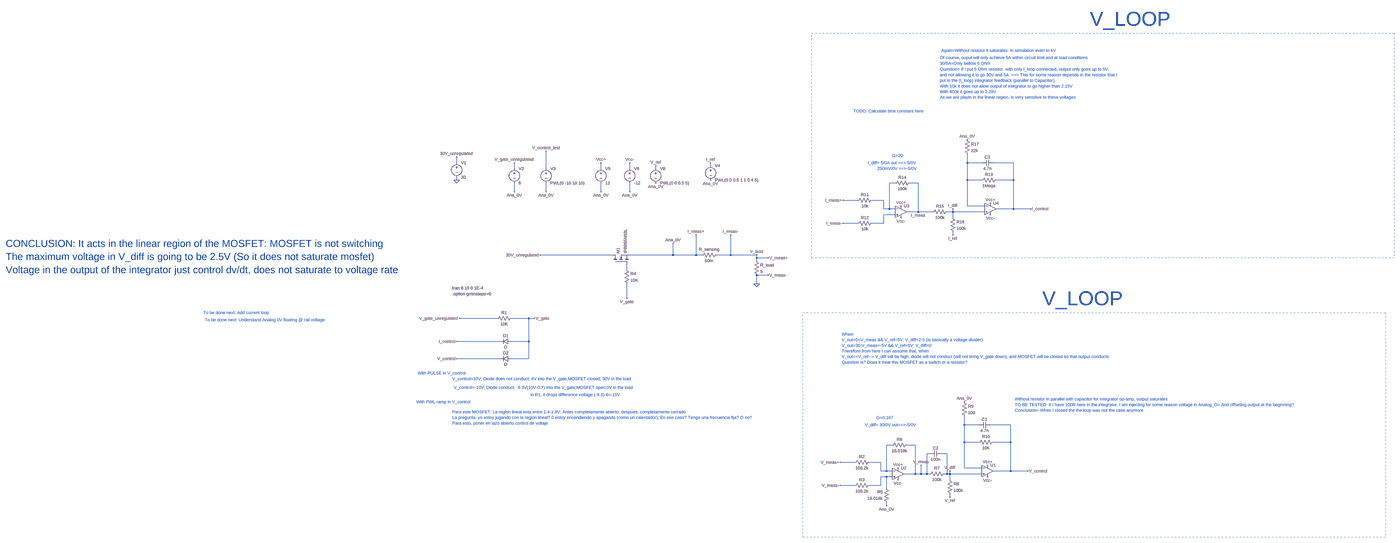
[diagram p0: schematic ControlSimulation_TOTAL_WORKING.asc, whole sheet]
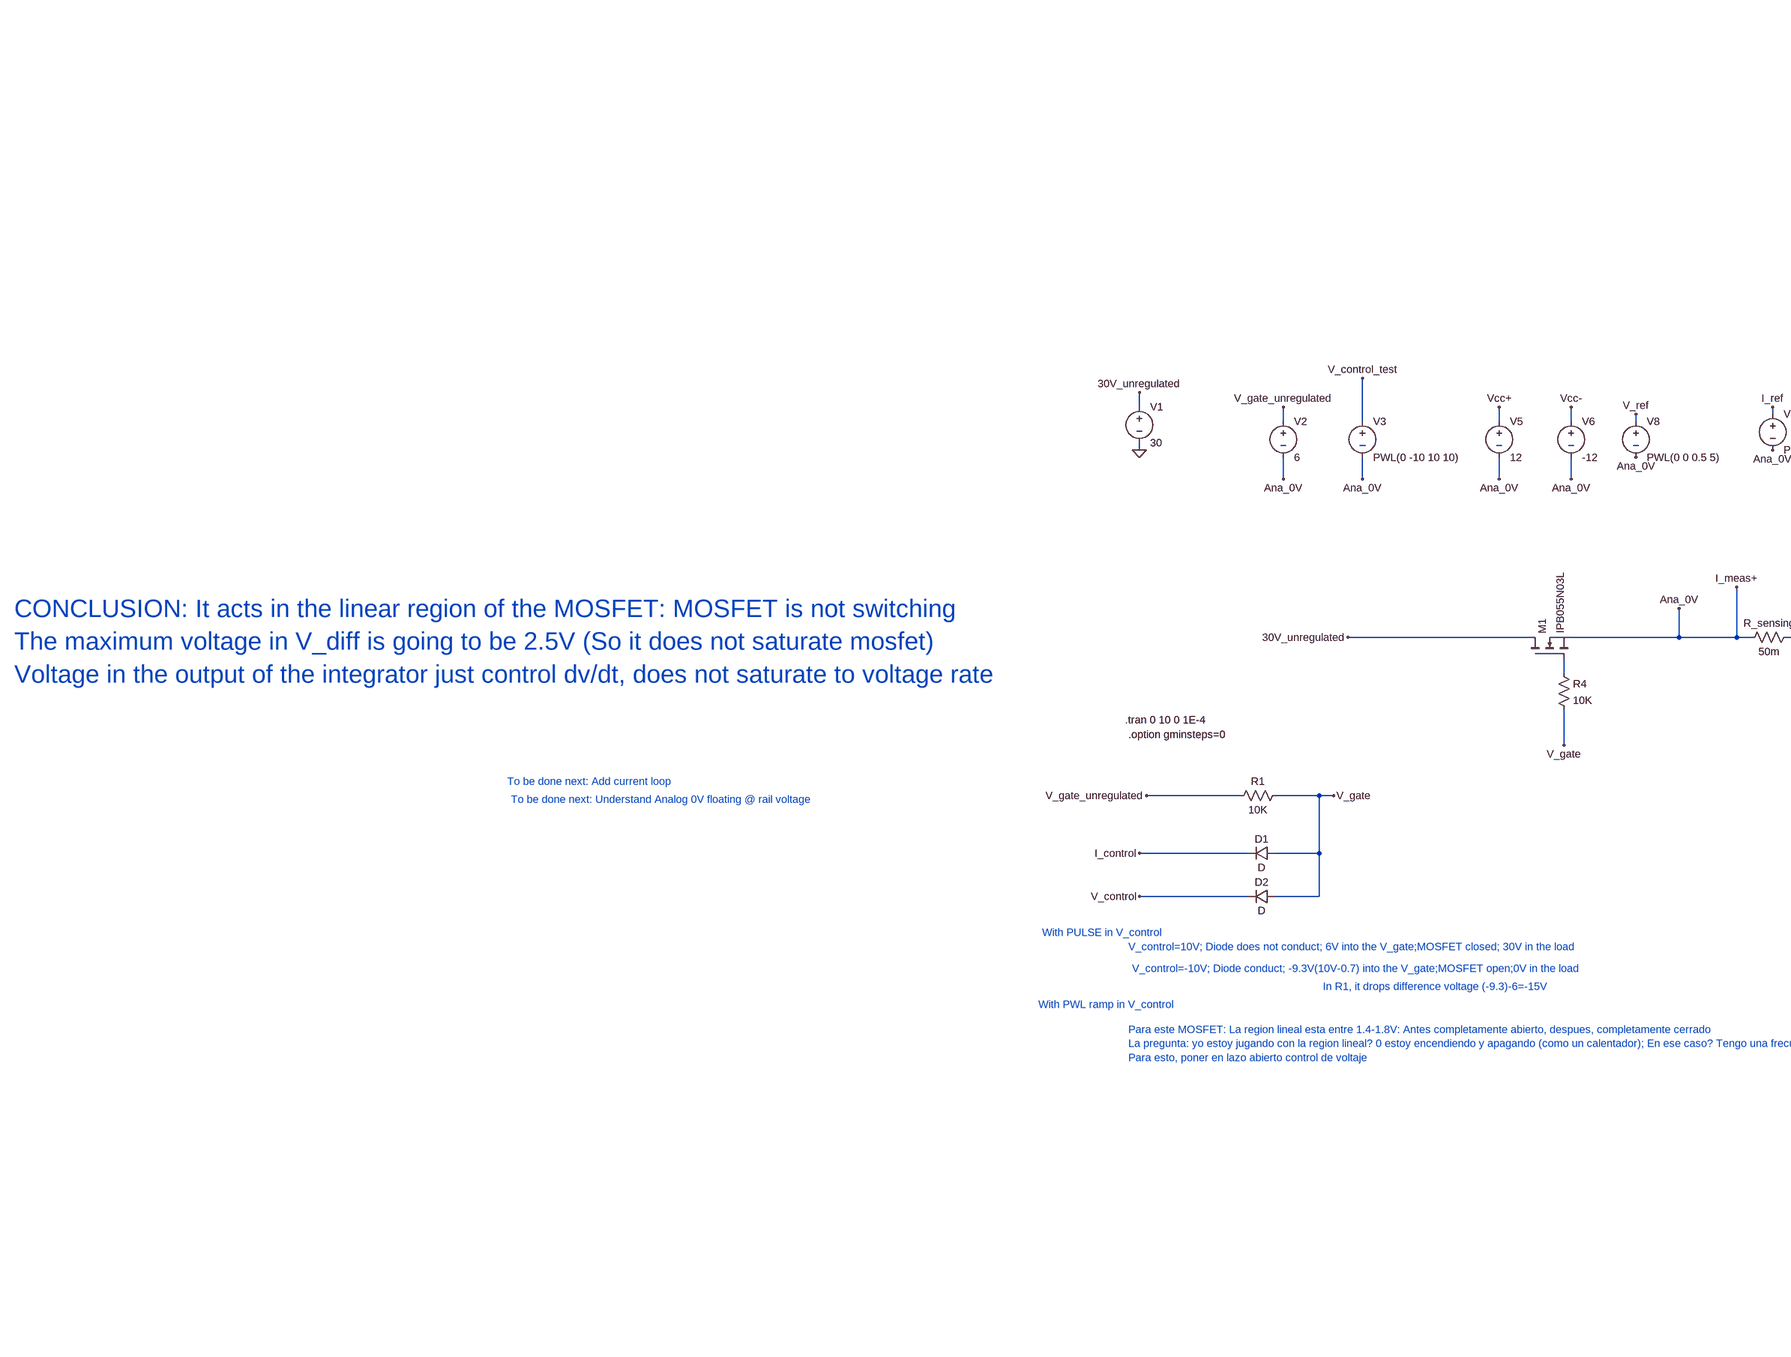
[diagram p1: schematic ControlSimulation_TOTAL_WORKING.asc, part, row 1 of 1, column 1 of 2]
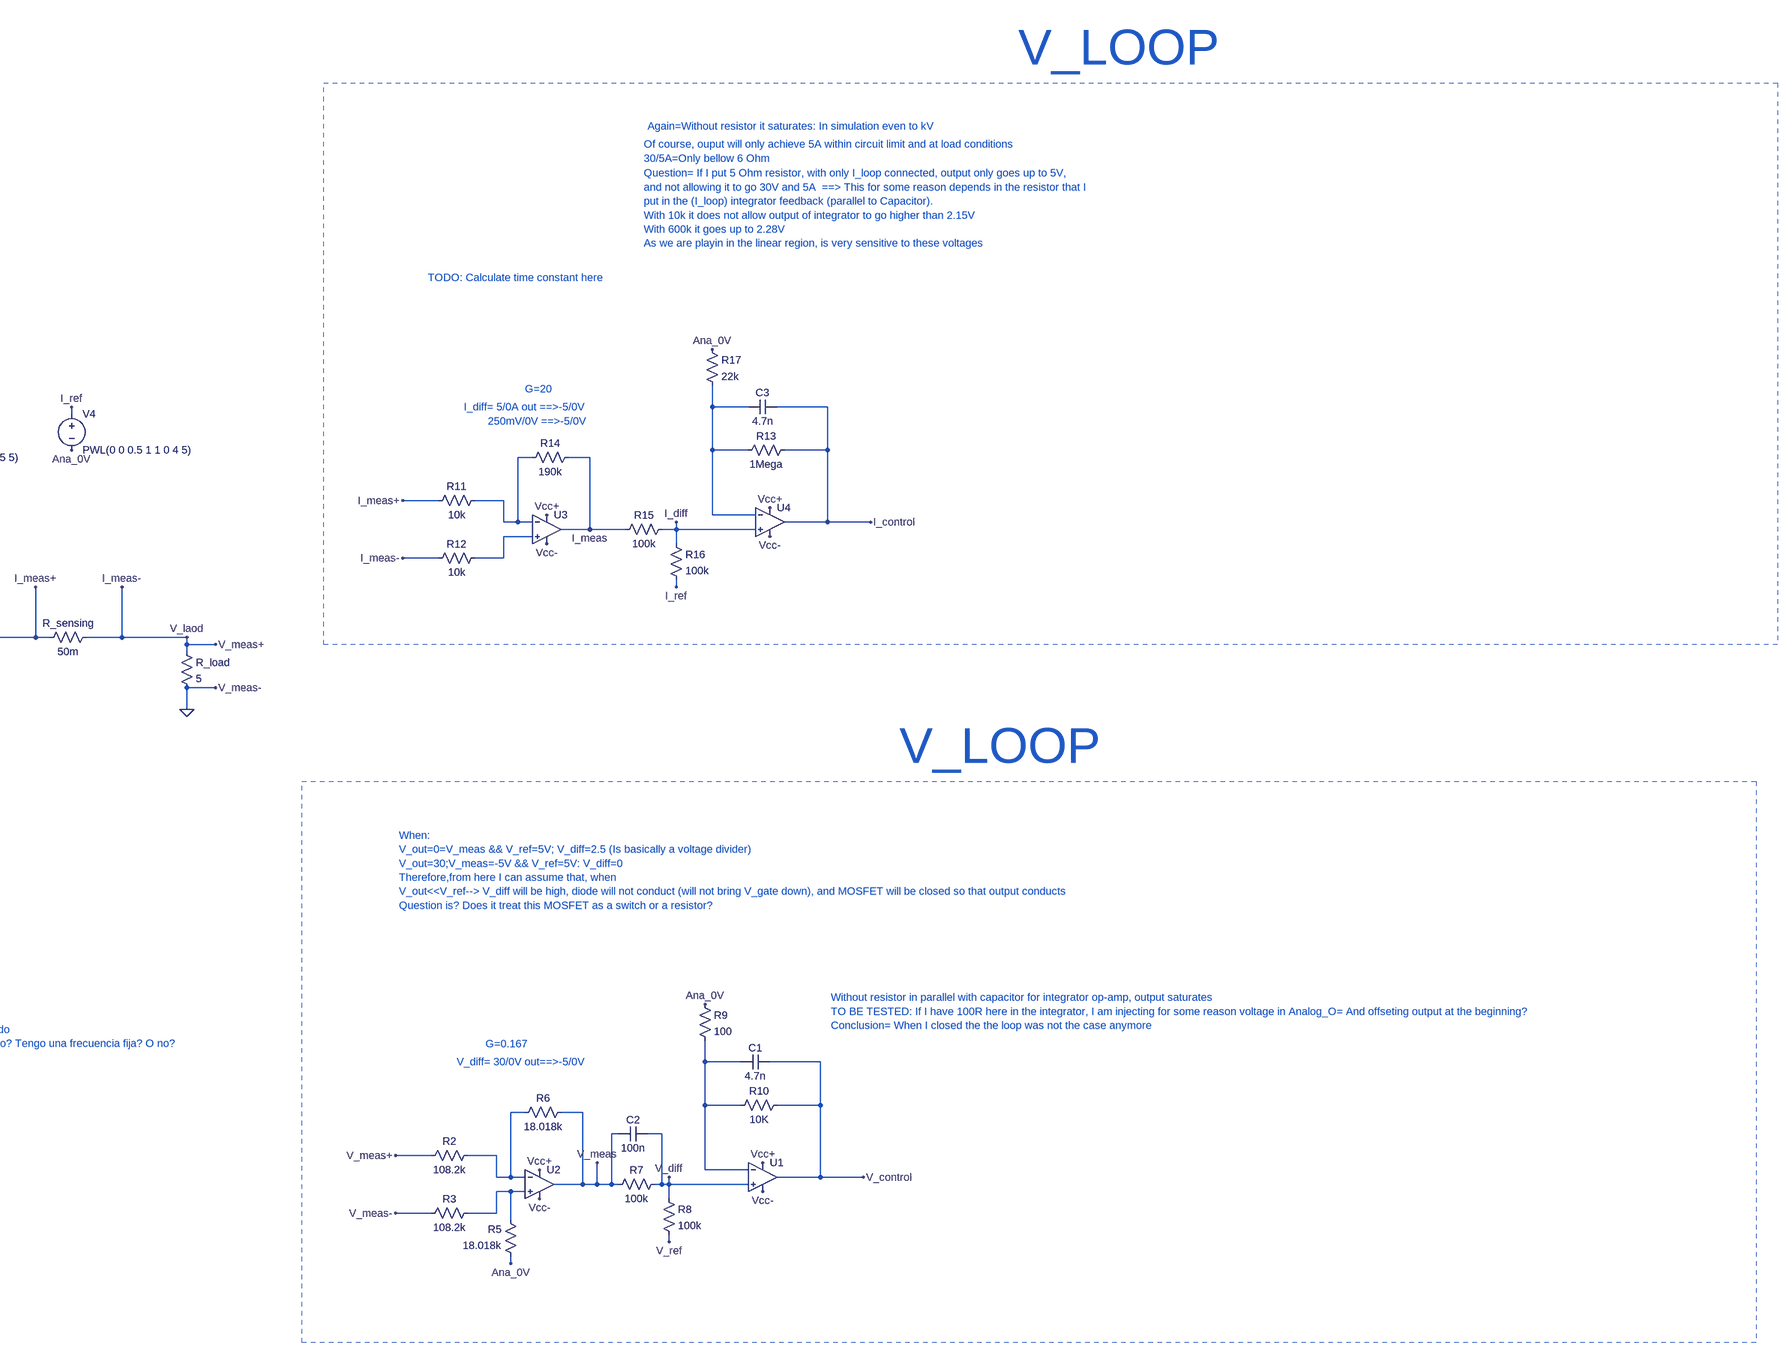
[diagram p2: schematic ControlSimulation_TOTAL_WORKING.asc, part, row 1 of 1, column 2 of 2]
ControlSimulation_TOTAL_WORKING.asc, the LTspice schematic file:
Version 4.1
SHEET 1 4756 1956
WIRE -448 -128 -448 -160
WIRE 2384 -128 2384 -176
WIRE 2464 -128 2384 -128
WIRE 2640 -128 2528 -128
WIRE 960 -112 960 -128
WIRE -128 -96 -128 -128
WIRE 48 -96 48 -192
WIRE 352 -96 352 -128
WIRE 512 -96 512 -128
WIRE 656 -96 656 -112
WIRE -448 -32 -448 -48
WIRE 2384 -32 2384 -128
WIRE 2464 -32 2384 -32
WIRE 2640 -32 2640 -128
WIRE 2640 -32 2544 -32
WIRE 1984 -16 1952 -16
WIRE 2112 -16 2064 -16
WIRE -128 32 -128 -16
WIRE 48 32 48 -16
WIRE 352 32 352 -16
WIRE 512 32 512 -16
WIRE 1776 80 1696 80
WIRE 1920 80 1856 80
WIRE 2384 112 2384 -32
WIRE 2480 112 2384 112
WIRE 1920 128 1920 80
WIRE 1952 128 1952 -16
WIRE 1952 128 1920 128
WIRE 1984 128 1952 128
WIRE 2640 128 2640 -32
WIRE 2640 128 2544 128
WIRE 2736 128 2640 128
WIRE 2112 144 2112 -16
WIRE 2112 144 2048 144
WIRE 2192 144 2112 144
WIRE 2304 144 2304 128
WIRE 2304 144 2272 144
WIRE 2480 144 2304 144
WIRE 1984 160 1920 160
WIRE 2304 176 2304 144
WIRE 1776 208 1696 208
WIRE 1920 208 1920 160
WIRE 1920 208 1856 208
WIRE 2304 272 2304 256
WIRE 416 384 16 384
WIRE 752 384 752 320
WIRE 752 384 512 384
WIRE 880 384 880 272
WIRE 880 384 752 384
WIRE 912 384 880 384
WIRE 1072 384 1072 272
WIRE 1072 384 992 384
WIRE 1216 384 1072 384
WIRE 1216 400 1216 384
WIRE 1280 400 1216 400
WIRE 1216 416 1216 400
WIRE 496 464 496 432
WIRE 1280 496 1216 496
WIRE 1216 544 1216 496
WIRE 496 624 496 544
WIRE -224 736 -432 736
WIRE -48 736 -144 736
WIRE -16 736 -48 736
WIRE -208 864 -448 864
WIRE -48 864 -48 736
WIRE -48 864 -144 864
WIRE -208 960 -448 960
WIRE -48 960 -48 864
WIRE -48 960 -144 960
WIRE 2368 1328 2368 1280
WIRE 2448 1328 2368 1328
WIRE 2624 1328 2512 1328
WIRE 2368 1424 2368 1328
WIRE 2448 1424 2368 1424
WIRE 2624 1424 2624 1328
WIRE 2624 1424 2528 1424
WIRE 1968 1440 1936 1440
WIRE 2096 1440 2048 1440
WIRE 2176 1488 2160 1488
WIRE 2272 1488 2240 1488
WIRE 1760 1536 1680 1536
WIRE 1904 1536 1840 1536
WIRE 2368 1568 2368 1424
WIRE 2464 1568 2368 1568
WIRE 1904 1584 1904 1536
WIRE 1936 1584 1936 1440
WIRE 1936 1584 1904 1584
WIRE 1968 1584 1936 1584
WIRE 2624 1584 2624 1424
WIRE 2624 1584 2528 1584
WIRE 2720 1584 2624 1584
WIRE 2096 1600 2096 1440
WIRE 2096 1600 2032 1600
WIRE 2128 1600 2128 1552
WIRE 2128 1600 2096 1600
WIRE 2160 1600 2160 1488
WIRE 2160 1600 2128 1600
WIRE 2176 1600 2160 1600
WIRE 2272 1600 2272 1488
WIRE 2272 1600 2256 1600
WIRE 2288 1600 2288 1584
WIRE 2288 1600 2272 1600
WIRE 2464 1600 2288 1600
WIRE 1936 1616 1904 1616
WIRE 1968 1616 1936 1616
WIRE 2288 1632 2288 1600
WIRE 1760 1664 1680 1664
WIRE 1904 1664 1904 1616
WIRE 1904 1664 1840 1664
WIRE 1936 1680 1936 1616
WIRE 2288 1728 2288 1712
WIRE 1936 1776 1936 1760
FLAG -448 -160 30V_unregulated
FLAG -448 -32 0
FLAG 16 384 30V_unregulated
FLAG 1216 544 0
FLAG 1216 384 V_laod
FLAG 496 624 V_gate
FLAG 752 320 Ana_0V
FLAG -128 32 Ana_0V
FLAG -128 -128 V_gate_unregulated
FLAG -432 736 V_gate_unregulated
FLAG -16 736 V_gate
FLAG -448 864 I_control
FLAG 48 32 Ana_0V
FLAG 48 -192 V_control_test
FLAG 352 32 Ana_0V
FLAG 352 -128 Vcc+
FLAG 512 32 Ana_0V
FLAG 512 -128 Vcc-
FLAG 2000 1568 Vcc+
FLAG 2000 1632 Vcc-
FLAG 656 -16 Ana_0V
FLAG 656 -112 V_ref
FLAG 1936 1776 Ana_0V
FLAG 2128 1552 V_meas
FLAG 2288 1728 V_ref
FLAG 2288 1584 V_diff
FLAG 2496 1552 Vcc+
FLAG 2496 1616 Vcc-
FLAG 2720 1584 V_control
FLAG 2368 1200 Ana_0V
FLAG 1280 400 V_meas+
FLAG 1280 496 V_meas-
FLAG 1680 1536 V_meas+
FLAG 1680 1664 V_meas-
FLAG 880 272 I_meas+
FLAG 1072 272 I_meas-
FLAG 2016 112 Vcc+
FLAG 2016 176 Vcc-
FLAG 2304 272 I_ref
FLAG 2304 128 I_diff
FLAG 2512 96 Vcc+
FLAG 2512 160 Vcc-
FLAG 2736 128 I_control
FLAG 2384 -256 Ana_0V
FLAG 1696 80 I_meas+
FLAG 1696 208 I_meas-
FLAG 960 -32 Ana_0V
FLAG 960 -128 I_ref
FLAG 2112 144 I_meas
FLAG -448 960 V_control
SYMBOL voltage -448 -144 R0
WINDOW 123 0 0 Left 0
WINDOW 39 0 0 Left 0
SYMATTR InstName V1
SYMATTR Value 30
SYMBOL nmos 416 432 R270
SYMATTR InstName M1
SYMATTR Value IPB055N03L
SYMBOL res 1200 400 R0
SYMATTR InstName R_load
SYMATTR Value 5
SYMBOL res 480 448 R0
SYMATTR InstName R4
SYMATTR Value 10K
SYMBOL res 1008 368 R90
WINDOW 0 0 56 VBottom 2
WINDOW 3 32 56 VTop 2
SYMATTR InstName R_sensing
SYMATTR Value 50m
SYMBOL voltage -128 -112 R0
WINDOW 123 0 0 Left 0
WINDOW 39 0 0 Left 0
SYMATTR InstName V2
SYMATTR Value 6
SYMBOL res -128 720 R90
WINDOW 0 0 56 VBottom 2
WINDOW 3 32 56 VTop 2
SYMATTR InstName R1
SYMATTR Value 10K
SYMBOL diode -144 848 R90
WINDOW 0 0 32 VBottom 2
WINDOW 3 32 32 VTop 2
SYMATTR InstName D1
SYMBOL voltage 48 -112 R0
WINDOW 123 0 0 Left 0
WINDOW 39 0 0 Left 0
SYMATTR InstName V3
SYMATTR Value PWL(0 -10 10 10)
SYMBOL voltage 352 -112 R0
WINDOW 123 0 0 Left 0
WINDOW 39 0 0 Left 0
SYMATTR InstName V5
SYMATTR Value 12
SYMBOL voltage 512 -112 R0
WINDOW 123 0 0 Left 0
WINDOW 39 0 0 Left 0
SYMATTR InstName V6
SYMATTR Value -12
SYMBOL voltage 656 -112 R0
WINDOW 123 0 0 Left 0
WINDOW 39 0 0 Left 0
SYMATTR InstName V8
SYMATTR Value PWL(0 0 0.5 5)
SYMBOL res 1856 1520 R90
WINDOW 0 0 56 VBottom 2
WINDOW 3 32 56 VTop 2
SYMATTR InstName R2
SYMATTR Value 108.2k
SYMBOL res 1856 1648 R90
WINDOW 0 0 56 VBottom 2
WINDOW 3 32 56 VTop 2
SYMATTR InstName R3
SYMATTR Value 108.2k
SYMBOL res 1952 1776 R180
WINDOW 0 36 76 Left 2
WINDOW 3 36 40 Left 2
SYMATTR InstName R5
SYMATTR Value 18.018k
SYMBOL res 2064 1424 R90
WINDOW 0 0 56 VBottom 2
WINDOW 3 32 56 VTop 2
SYMATTR InstName R6
SYMATTR Value 18.018k
SYMBOL res 2272 1584 R90
WINDOW 0 0 56 VBottom 2
WINDOW 3 32 56 VTop 2
SYMATTR InstName R7
SYMATTR Value 100k
SYMBOL res 2272 1616 R0
SYMATTR InstName R8
SYMATTR Value 100k
SYMBOL cap 2512 1312 R90
WINDOW 0 0 32 VBottom 2
WINDOW 3 32 32 VTop 2
SYMATTR InstName C1
SYMATTR Value 4.7n
SYMBOL res 2352 1184 R0
SYMATTR InstName R9
SYMATTR Value 100
SYMBOL res 2544 1408 R90
WINDOW 0 0 56 VBottom 2
WINDOW 3 32 56 VTop 2
SYMATTR InstName R10
SYMATTR Value 10K
SYMBOL OpAmps\\UniversalOpAmp1 2000 1600 R0
SYMATTR InstName U2
SYMBOL OpAmps\\UniversalOpAmp1 2496 1584 R0
SYMATTR InstName U1
SYMBOL cap 2240 1472 R90
WINDOW 0 0 32 VBottom 2
WINDOW 3 32 32 VTop 2
SYMATTR InstName C2
SYMATTR Value 100n
SYMBOL res 1872 64 R90
WINDOW 0 0 56 VBottom 2
WINDOW 3 32 56 VTop 2
SYMATTR InstName R11
SYMATTR Value 10k
SYMBOL res 1872 192 R90
WINDOW 0 0 56 VBottom 2
WINDOW 3 32 56 VTop 2
SYMATTR InstName R12
SYMATTR Value 10k
SYMBOL res 2080 -32 R90
WINDOW 0 0 56 VBottom 2
WINDOW 3 32 56 VTop 2
SYMATTR InstName R14
SYMATTR Value 190k
SYMBOL res 2288 128 R90
WINDOW 0 0 56 VBottom 2
WINDOW 3 32 56 VTop 2
SYMATTR InstName R15
SYMATTR Value 100k
SYMBOL res 2288 160 R0
SYMATTR InstName R16
SYMATTR Value 100k
SYMBOL cap 2528 -144 R90
WINDOW 0 0 32 VBottom 2
WINDOW 3 32 32 VTop 2
SYMATTR InstName C3
SYMATTR Value 4.7n
SYMBOL res 2368 -272 R0
SYMATTR InstName R17
SYMATTR Value 22k
SYMBOL OpAmps\\UniversalOpAmp1 2016 144 R0
SYMATTR InstName U3
SYMBOL OpAmps\\UniversalOpAmp1 2512 128 R0
SYMATTR InstName U4
SYMBOL voltage 960 -128 R0
WINDOW 123 0 0 Left 0
WINDOW 39 0 0 Left 0
SYMATTR InstName V4
SYMATTR Value PWL(0 0 0.5 1 1 0 4 5)
SYMBOL res 2560 -48 R90
WINDOW 0 0 56 VBottom 2
WINDOW 3 32 56 VTop 2
SYMATTR InstName R13
SYMATTR Value 1Mega
SYMBOL diode -144 944 R90
WINDOW 0 0 32 VBottom 2
WINDOW 3 32 32 VTop 2
SYMATTR InstName D2
TEXT -480 568 Left 2 !.tran 0 10 0 1E-4
TEXT -472 1072 Left 2 ;V_control=10V; Diode does not conduct; 6V into the V_gate;MOSFET closed; 30V in the load
TEXT -464 1120 Left 2 ;V_control=-10V; Diode conduct; -9.3V(10V-0.7) into the V_gate;MOSFET open;0V in the load
TEXT -40 1160 Left 2 ;In R1, it drops difference voltage (-9.3)-6=-15V
TEXT -664 1040 Left 2 ;With PULSE in V_control
TEXT -672 1200 Left 2 ;With PWL ramp in V_control
TEXT -472 1256 Left 2 ;Para este MOSFET: La region lineal esta entre 1.4-1.8V: Antes completamente abierto, despues, completamente cerrado\nLa pregunta: yo estoy jugando con la region lineal? 0 estoy encendiendo y apagando (como un calentador); En ese caso? Tengo una frecuencia fija? O no?\nPara esto, poner en lazo abierto control de voltaje
TEXT 1816 1328 Left 2 ;V_diff= 30/0V out==>-5/0V
TEXT 1688 824 Left 2 ;When:\nV_out=0=V_meas && V_ref=5V; V_diff=2.5 (Is basically a voltage divider)\nV_out=30;V_meas=-5V && V_ref=5V: V_diff=0\nTherefore,from here I can assume that, when\nV_out<<V_ref--> V_diff will be high, diode will not conduct (will not bring V_gate down), and MOSFET will be closed so that output conducts\nQuestion is? Does it treat this MOSFET as a switch or a resistor?
TEXT -472 600 Left 2 !.option gminsteps=0
TEXT 2648 1184 Left 2 ;Without resistor in parallel with capacitor for integrator op-amp, output saturates
TEXT 2648 1216 Left 2 ;TO BE TESTED: If I have 100R here in the integrator, I am injecting for some reason voltage in Analog_O= And offseting output at the beginning?\nConclusion= When I closed the the loop was not the case anymore
TEXT -3304 320 Left 5 ;CONCLUSION: It acts in the linear region of the MOSFET: MOSFET is not switching\nThe maximum voltage in V_diff is going to be 2.5V (So it does not saturate mosfet)\nVoltage in the output of the integrator just control dv/dt, does not saturate to voltage rate
TEXT -2208 704 Left 2 ;To be done next: Add current loop
TEXT 2800 624 Left 7 ;V_LOOP
TEXT 1832 -128 Left 2 ;I_diff= 5/0A out ==>-5/0V\n        250mV/0V ==>-5/0V
TEXT 1752 -416 Left 2 ;TODO: Calculate time constant here
TEXT -2200 744 Left 2 ;To be done next: Understand Analog 0V floating @ rail voltage
TEXT 1968 -168 Left 2 ;G=20
TEXT 1880 1288 Left 2 ;G=0.167
TEXT 2240 -752 Left 2 ;Again=Without resistor it saturates: In simulation even to kV
TEXT 2232 -712 Left 2 ;Of course, ouput will only achieve 5A within circuit limit and at load conditions\n30/5A=Only bellow 6 Ohm
TEXT 2232 -648 Left 2 ;Question= If I put 5 Ohm resistor, with only I_loop connected, output only goes up to 5V,\nand not allowing it to go 30V and 5A  ==> This for some reason depends in the resistor that I \nput in the (I_loop) integrator feedback (parallel to Capacitor).\nWith 10k it does not allow output of integrator to go higher than 2.15V\nWith 600k it goes up to 2.28V\nAs we are playin in the linear region, is very sensitive to these voltages
TEXT 3064 -928 Left 7 ;V_LOOP
RECTANGLE Normal 4704 1952 1472 704 2
RECTANGLE Normal 4752 400 1520 -848 2

The netlist it stands for:
* ControlSimulation_TOTAL_WORKING.asc
V1 30V_unregulated 0 30
M1 30V_unregulated N004 I_meas+ I_meas+ IPB055N03L
R_load I_meas- 0 5
R4 N004 V_gate 10K
R_sensing I_meas- I_meas+ 50m
V2 V_gate_unregulated I_meas+ 6
R1 V_gate V_gate_unregulated 10K
D1 V_gate I_control D
V3 V_control_test I_meas+ PWL(0 -10 10 10)
V5 Vcc+ I_meas+ 12
V6 Vcc- I_meas+ -12
V8 V_ref I_meas+ PWL(0 0 0.5 5)
R2 N006 I_meas- 108.2k
R3 N007 0 108.2k
R5 I_meas+ N007 18.018k
R6 V_meas N006 18.018k
R7 V_diff V_meas 100k
R8 V_diff V_ref 100k
C1 V_control N005 4.7n
R9 I_meas+ N005 100
R10 V_control N005 10K
X§U2 N007 N006 Vcc+ Vcc- V_meas level1 Avol=1Meg GBW=10Meg Vos=0 En=0 Enk=0 In=0 Ink=0 Rin=500Meg  ; pins In+ In- V+ V- OUT
X§U1 V_diff N005 Vcc+ Vcc- V_control level1 Avol=1Meg GBW=10Meg Vos=0 En=0 Enk=0 In=0 Ink=0 Rin=500Meg  ; pins In+ In- V+ V- OUT
C2 V_diff V_meas 100n
R11 N002 I_meas+ 10k
R12 N003 I_meas- 10k
R14 I_meas N002 190k
R15 I_diff I_meas 100k
R16 I_diff I_ref 100k
C3 I_control N001 4.7n
R17 I_meas+ N001 22k
X§U3 N003 N002 Vcc+ Vcc- I_meas level1 Avol=1Meg GBW=10Meg Vos=0 En=0 Enk=0 In=0 Ink=0 Rin=500Meg  ; pins In+ In- V+ V- OUT
X§U4 I_diff N001 Vcc+ Vcc- I_control level1 Avol=1Meg GBW=10Meg Vos=0 En=0 Enk=0 In=0 Ink=0 Rin=500Meg  ; pins In+ In- V+ V- OUT
V4 I_ref I_meas+ PWL(0 0 0.5 1 1 0 4 5)
R13 I_control N001 1Mega
D2 V_gate V_control D
.model D D
.lib standard.dio
.model NMOS NMOS
.model PMOS PMOS
.lib standard.mos
.tran 0 10 0 1E-4
* V_control=10V; Diode does not conduct; 6V into the V_gate;MOSFET closed; 30V in the load
* V_control=-10V; Diode conduct; -9.3V(10V-0.7) into the V_gate;MOSFET open;0V in the load
* In R1, it drops difference voltage (-9.3)-6=-15V
* With PULSE in V_control
* With PWL ramp in V_control
* Para este MOSFET: La region lineal esta entre 1.4-1.8V: Antes completamente abierto, despues, completamente cerrado
* La pregunta: yo estoy jugando con la region lineal? 0 estoy encendiendo y apagando (como un calentador); En ese caso? Tengo una frecuencia fija? O no?
* Para esto, poner en lazo abierto control de voltaje
* V_diff= 30/0V out==>-5/0V
* When:
* V_out=0=V_meas && V_ref=5V; V_diff=2.5 (Is basically a voltage divider)
* V_out=30;V_meas=-5V && V_ref=5V: V_diff=0
* Therefore,from here I can assume that, when
* V_out<<V_ref--> V_diff will be high, diode will not conduct (will not bring V_gate down), and MOSFET will be closed so that output conducts
* Question is? Does it treat this MOSFET as a switch or a resistor?
.option gminsteps=0
* Without resistor in parallel with capacitor for integrator op-amp, output saturates
* TO BE TESTED: If I have 100R here in the integrator, I am injecting for some reason voltage in Analog_O= And offseting output at the beginning?
* Conclusion= When I closed the the loop was not the case anymore
* CONCLUSION: It acts in the linear region of the MOSFET: MOSFET is not switching
* The maximum voltage in V_diff is going to be 2.5V (So it does not saturate mosfet)
* Voltage in the output of the integrator just control dv/dt, does not saturate to voltage rate
* To be done next: Add current loop
* V_LOOP
* I_diff= 5/0A out ==>-5/0V
*         250mV/0V ==>-5/0V
* TODO: Calculate time constant here
* To be done next: Understand Analog 0V floating @ rail voltage
* G=20
* G=0.167
* Again=Without resistor it saturates: In simulation even to kV
* Of course, ouput will only achieve 5A within circuit limit and at load conditions
* 30/5A=Only bellow 6 Ohm
* Question= If I put 5 Ohm resistor, with only I_loop connected, output only goes up to 5V,
* and not allowing it to go 30V and 5A  ==> This for some reason depends in the resistor that I
* put in the (I_loop) integrator feedback (parallel to Capacitor).
* With 10k it does not allow output of integrator to go higher than 2.15V
* With 600k it goes up to 2.28V
* As we are playin in the linear region, is very sensitive to these voltages
* V_LOOP
.lib UniversalOpAmp1.lib
.backanno
.end